# Altium schematic sheet fuentes_15V_5V_3.3V.SchDoc
size A3; PageSetup: Record=PageOptions|CenterHorizontal=True|CenterVertical=True|PrintScale=0.70|XCorrection=1.00|YCorrection=1.00|PrintKind=1|BorderSize=5000000|LeftOffset=0|BottomOffset=0|Orientation=2|PaperLength=1000|PaperWidth=1000|Scale=100|PaperSource=1|PrintQuality=300|MediaType=1|DitherType=10|PaperKind=A4|PrintScaleMode=1
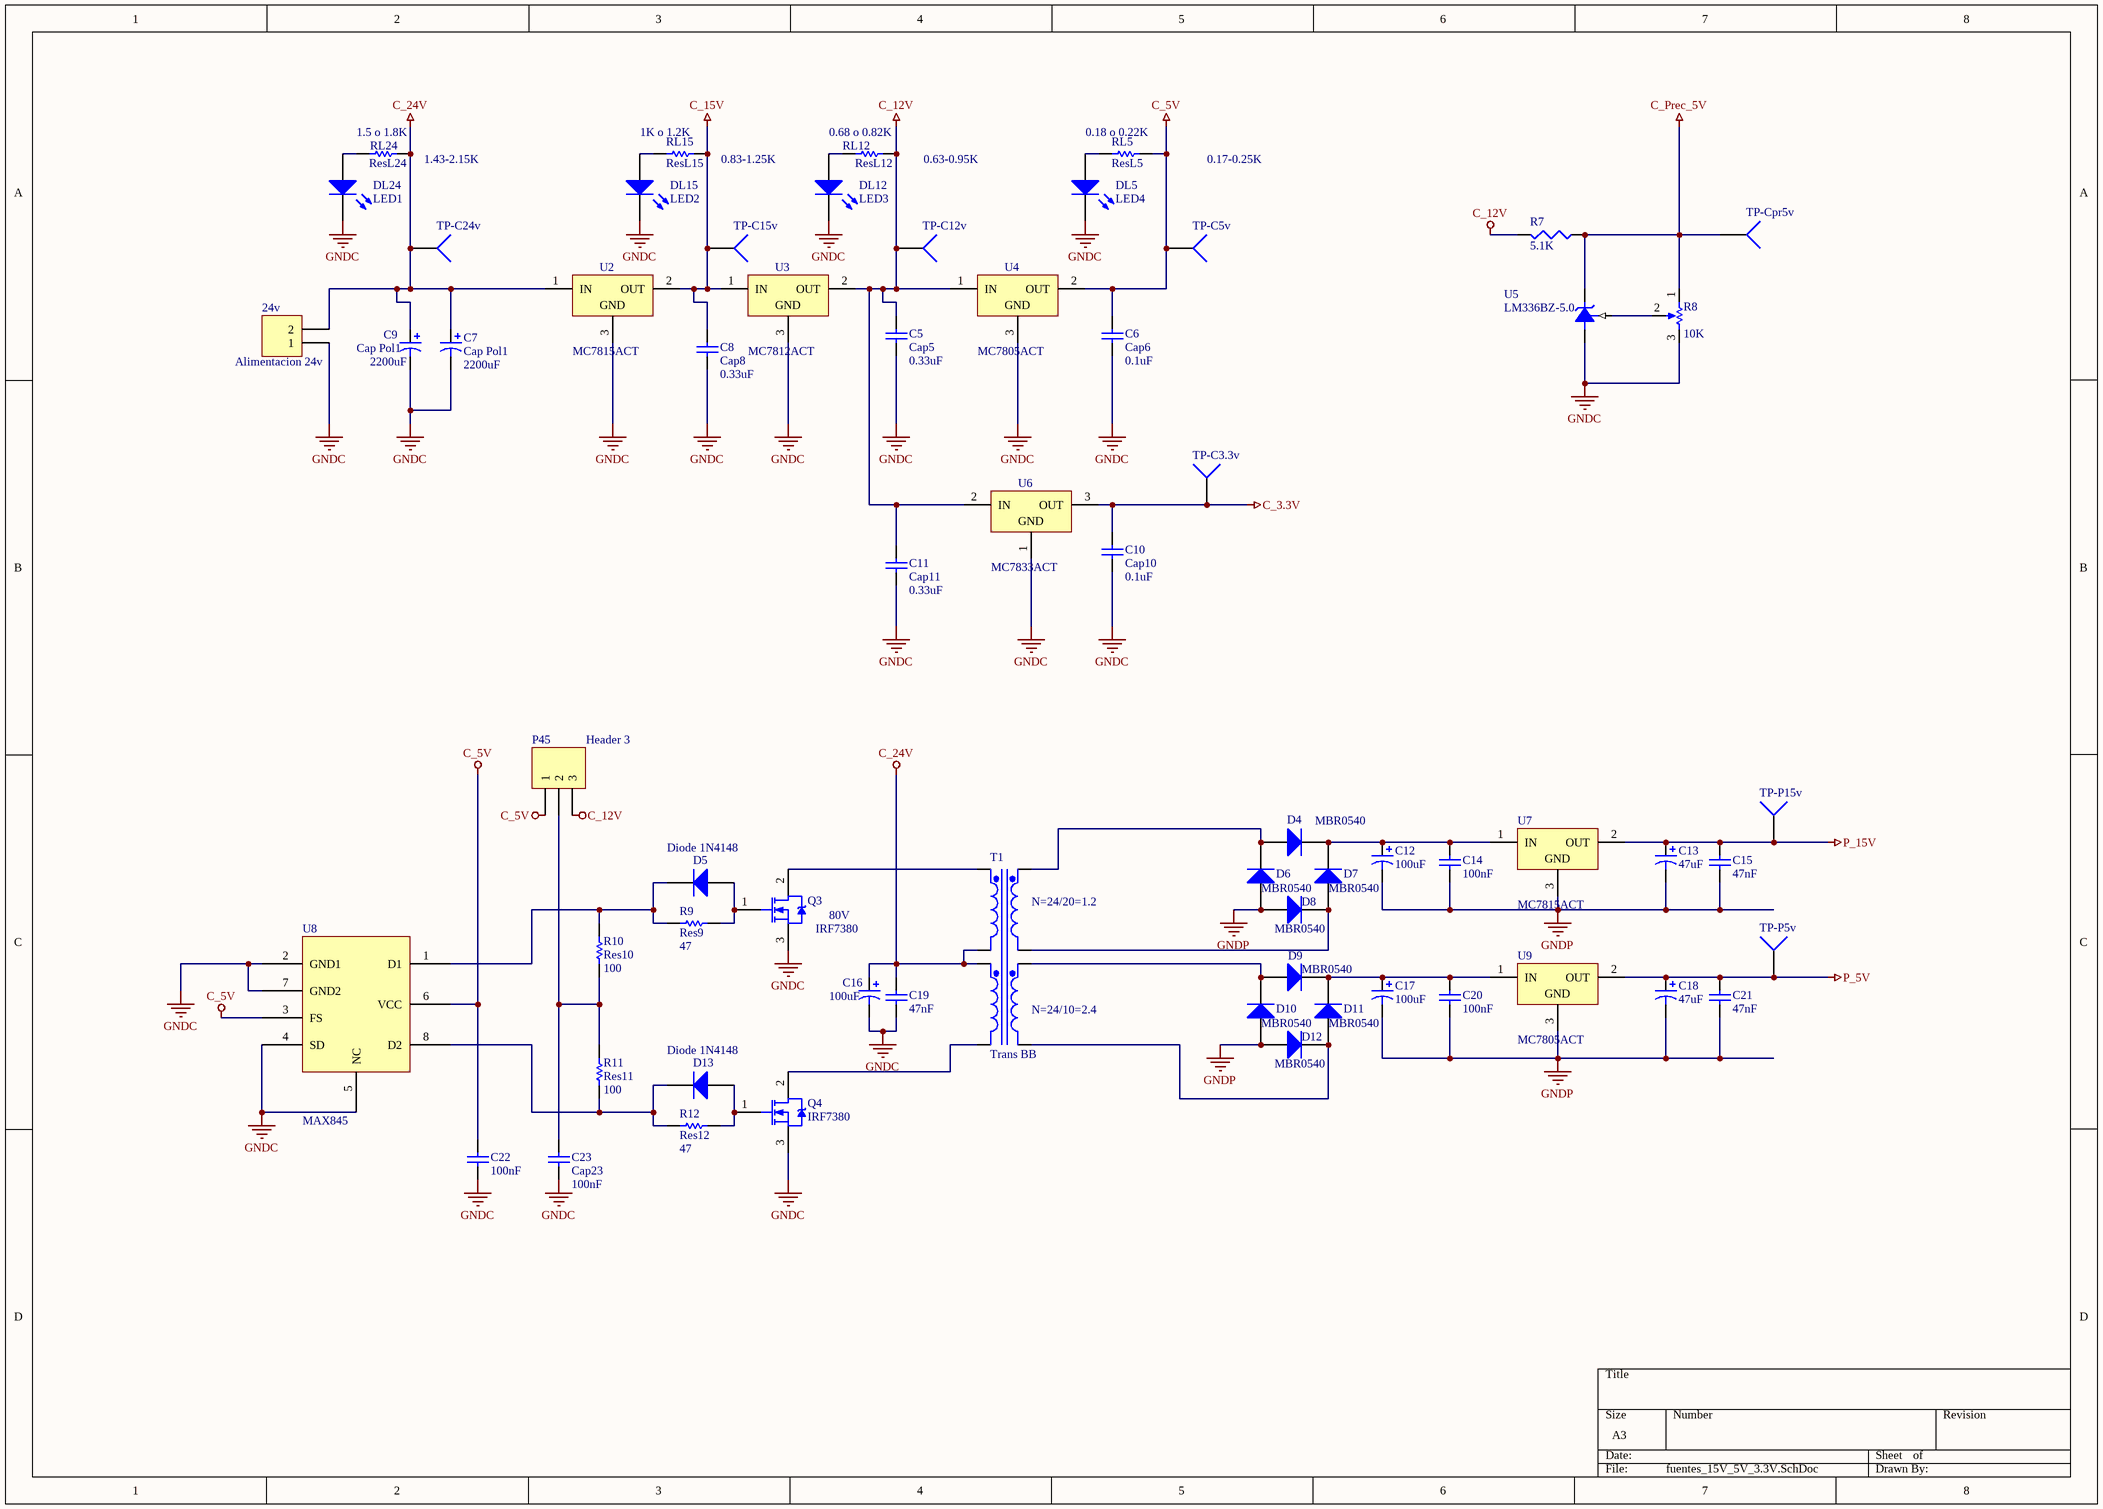
[diagram p0: fuentes_15V_5V_3.3V.SchDoc]

## Parts
24v  Alimentacion 24v  [HDR1X2-POT*]
C5  Cap5  value 0.33uF  [8-1206]
C6  Cap6  value 0.1uF  [8-1206]
C7  Cap Pol1  value 2200uF  [RB7.6-18.2*]
C8  Cap8  value 0.33uF  [8-1206]
C9  Cap Pol1  value 2200uF  [RB7.6-18.2*]
C10  Cap10  value 0.1uF  [8-1206]
C11  Cap11  value 0.33uF  [8-1206]
C12  value 100uF  [RB3.5-8*]  (hidden comment: Cap Pol1)
C13  value 47uF  [RB5.8-6.4*]  (hidden comment: Cap Pol1)
C14  value 100nF  [8-1206]  (hidden comment: Cap14)
C15  value 47nF  [8-1206]  (hidden comment: Cap15)
C16  value 100uF  [RB3.5-8*]  (hidden comment: Cap Pol1)
C17  value 100uF  [RB3.5-8*]  (hidden comment: Cap Pol1)
C18  value 47uF  [RB5.8-6.4*]  (hidden comment: Cap Pol1)
C19  value 47nF  [8-1206]  (hidden comment: Cap19)
C20  value 100nF  [8-1206]  (hidden comment: Cap20)
C21  value 47nF  [8-1206]  (hidden comment: Cap21)
C22  value 100nF  [8-1206]  (hidden comment: Cap22)
C23  Cap23  value 100nF  [8-1206]
D4  MBR0540  [CASE403A*]
D5  Diode 1N4148  [DO-35]
D6  MBR0540  [CASE403A*]
D7  MBR0540  [CASE403A*]
D8  MBR0540  [CASE403A*]
D9  MBR0540  [CASE403A*]
D10  MBR0540  [CASE403A*]
D11  MBR0540  [CASE403A*]
D12  MBR0540  [CASE403A*]
D13  Diode 1N4148  [DO-35]
DL5  LED4  [LED-1*]
DL12  LED3  [LED-1*]
DL15  LED2  [LED-1*]
DL24  LED1  [LED-1*]
P45  Header 3  [HDR1X3*]
Q3  IRF7380  [TO220-MOS]
Q4  IRF7380  [TO220-MOS]
R7  value 5.1K  [AXIAL-0.4]  (hidden comment: Res7)
R8  value 10K  [VR*]  (hidden comment: RPot)
R9  Res9  value 47  [8-1206]
R10  Res10  value 100  [8-1206]
R11  Res11  value 100  [8-1206]
R12  Res12  value 47  [8-1206]
RL5  ResL5  value 0.18 o 0.22K  [8-1206]
RL12  ResL12  value 0.68 o 0.82K  [8-1206]
RL15  ResL15  value 1K o 1.2K  [8-1206]
RL24  ResL24  value 1.5 o 1.8K  [8-1206]
T1  Trans BB  [TRAFO-2PRI-2SEC]
TP-C3.3v  (no value)  [PIN1]
TP-C5v  (no value)  [PIN1]
TP-C12v  (no value)  [PIN1]
TP-C15v  (no value)  [PIN1]
TP-C24v  (no value)  [PIN1]
TP-Cpr5v  (no value)  [PIN1]
TP-P5v  (no value)  [PIN1]
TP-P15v  (no value)  [PIN1]
U2  MC7815ACT  [TO220*]
U3  MC7812ACT  [TO220*]
U4  MC7805ACT  [TO220*]
U5  LM336BZ-5.0  [Z03A]
U6  MC7833ACT  [TO220*]
U7  MC7815ACT  [TO220*]
U8  MAX845  [SO-8]
U9  MC7805ACT  [TO220*]

## Nets
C_3.3V: C10.1 TP-C3.3v.1 U6.3(OUT)
C_5V: C6.1 C22.2 P45.1 RL5.2 TP-C5v.1 U4.2(OUT) U8.3(FS) U8.6(VCC)
C_12V: C5.1 C11.1 P45.3 R7.2 RL12.2 TP-C12v.1 U3.2(OUT) U4.1(IN) U6.2(IN)
C_15V: C8.1 RL15.2 TP-C15v.1 U2.2(OUT) U3.1(IN)
C_24V: 24v.2 C7.1 C9.1 C16.1 C19.2 RL24.2 T1.2(Pri1-) T1.3(Pri2+) TP-C24v.1 U2.1(IN)
C_Prec_5V: R7.1 R8.1(TOP) TP-Cpr5v.1 U5.2(+V)
GNDC: 24v.1 C5.2 C6.2 C7.2 C8.2 C9.2 C10.2 C11.2 C16.2 C19.1 C22.1 C23.2 DL5.2(K) DL12.2(K) DL15.2(K) DL24.2(K) Q3.3(S) Q4.3(S) R8.3(BOT) U2.3(GND) U3.3(GND) U4.3(GND) U5.1(-V) U6.1(GND) U8.2(GND1) U8.4(SD) U8.5(NC) U8.7(GND2)
GNDP: C12.2 C13.2 C14.1 C15.1 C17.2 C18.2 C20.1 C21.1 D6.1(A) D8.1(A) D10.1(A) D12.1(A) U7.3(GND) U9.3(GND)
P_5V: C18.1 C21.2 TP-P5v.1 U9.2(OUT)
P_15V: C13.1 C15.2 TP-P15v.1 U7.2(OUT)
NetC12_1: C12.1 C14.2 D4.2(K) D7.2(K) U7.1(IN)
NetC17_1: C17.1 C20.2 D9.2(K) D11.2(K) U9.1(IN)
NetC23_1: C23.1 P45.2 R10.2 R11.1
NetD4_1: D4.1(A) D6.2(K) T1.5(Sec1+)
NetD5_1: D5.1(A) Q3.1(G) R9.2
NetD5_2: D5.2(K) R9.1 R10.1 U8.1(D1)
NetD7_1: D7.1(A) D8.2(K) T1.6(Sec1-)
NetD9_1: D9.1(A) D10.2(K) T1.7(Sec2+)
NetD11_1: D11.1(A) D12.2(K) T1.8(Sec2-)
NetD13_1: D13.1(A) Q4.1(G) R12.2
NetD13_2: D13.2(K) R11.2 R12.1 U8.8(D2)
NetDL5_1: DL5.1(A) RL5.1
NetDL12_1: DL12.1(A) RL12.1
NetDL15_1: DL15.1(A) RL15.1
NetDL24_1: DL24.1(A) RL24.1
NetQ3_2: Q3.2(D) T1.1(Pri1+)
NetQ4_2: Q4.2(D) T1.4(Pri2-)
NetR8_2: R8.2(TAP) U5.3(ADJ)

## Notes on the sheet
- (near RL24) 1.43-2.15K
- (near RL15) 0.83-1.25K
- (near RL12) 0.63-0.95K
- 0.17-0.25K
- (near Q3) 80V
- (near T1) N=24/20=1.2
- (near T1) N=24/10=2.4

## Library data of the parts
24v = Header 2: Header, 2-Pin; LatestRevisionDate: 17-Jul-2002; LatestRevisionNote: Re-released for DXP Platform.; Publisher: Altium Limited
C5 C6 C8 C10 C11 C14 C15 C19-C23 = Cap: SMD MULTICAPA 50V; Published: 8-Jun-2000; LatestRevisionDate: 17-Jul-2002; LatestRevisionNote: Re-released for DXP Platform.; PackageReference: RAD-0.3; Publisher: Altium Limited
  C5 C6 C8 C10 C11 C23: PackageDescription: Radial Cap, Thru-Hole; 2 Leads; 0.3 in Pin Spacing
C7 C9 C12 C13 C16-C18 = Cap Pol1: Polarized Capacitor (Radial); Published: 8-Jun-2000; LatestRevisionDate: 17-Jul-2002; LatestRevisionNote: Re-released for DXP Platform.; PackageReference: RB7.6-15; Publisher: Altium Limited
D4 D6-D12 = Diode: SMD; Published: 8-Jun-2000; LatestRevisionDate: 17-Jul-2002; LatestRevisionNote: Re-released for DXP Platform.; PackageDocument: Sep-1996; PackageReference: SMC; Publisher: Altium Limited; Code_JEDEC: DO-214-AB
D5 D13 = Diode 1N4148: THRU; Published: 8-Jun-2000; LatestRevisionDate: 17-Jul-2002; LatestRevisionNote: Re-released for DXP Platform.; DatasheetVersion: 1997; PackageReference: DO-35; Publisher: Altium Limited; PackageDescription: Diode, Axial; Body 3.8 x 1.9 mm (LxDia. max), Lead Dia. 0.53 mm (max); Code_JEDEC: DO-204-AH; ComponentLink1Description: Manufacturer Link; ComponentLink1URL: http://www.fairchildsemi.com/; ComponentLink2Description: Datasheet; ComponentLink2URL: http://www.fairchildsemi.com/ds/1N%2F1N4148.pdf
DL5 DL12 DL15 DL24 = LED1: Typical RED GaAs LED; Published: 8-Jun-2000; LatestRevisionDate: 08-Jul-2005; LatestRevisionNote: Mech Layer 1 removed.; PackageReference: LED-1; Publisher: Altium Limited; PackageDescription: LED; 2 Leads
P45 = Header 3: Header, 3-Pin; LatestRevisionDate: 17-Jul-2002; LatestRevisionNote: Re-released for DXP Platform.; Publisher: Altium Limited
Q3 Q4 = IRFP250: HEXFET Power MOSFET; Note: Pin 2 is electrically connected to the Heatsink (4).; LatestRevisionDate: 17-Jul-2002; LatestRevisionNote: Re-released for DXP Platform.; DatasheetVersion: PD-9.443D; PackageVersion: Aug-1997; PackageReference: TO-247AC; Publisher: Altium Limited; PackageDescription: SIP with Mounting Hole; 3 Leads; Body 20 x 15.6 x 5 mm (typ); Pitch 5.45 mm; Code_JEDEC: TO-247-AC; ComponentLink1Description: Manufacturer Link; ComponentLink1URL: http://www.irf.com/; ComponentLink2Description: Datasheet; ComponentLink2URL: http://www.irf.com/product-info/datasheets/data/irfp250.pdf
  Q4: Published: 8-Jun-2000
R7 = Res3: Resistor; Published: 8-Jun-2000; LatestRevisionDate: 04-Mar-2005; LatestRevisionNote: PCB Footprint replaced.; PackageReference: J1-0603; Publisher: Altium Limited
R8 = RPot: PRESET MULTIVUELTA VERTICAL; Sim Note: Enter the Resistance value and the set point into parameter fields.; Set Position: 0.5; Published: 8-Jun-2000; LatestRevisionDate: 17-Jul-2002; LatestRevisionNote: Re-released for DXP Platform.; PackageReference: VR5; Publisher: Altium Limited
R9 R12 RL5 RL12 RL15 RL24 = Res1: SMD 1206; Published: 8-Jun-2000; LatestRevisionDate: 17-Jul-2002; LatestRevisionNote: Re-released for DXP Platform.; PackageReference: AXIAL-0.3; Publisher: Altium Limited; PackageDescription: Axial Device, Thru-Hole; 2 Leads; 0.3 in Pin Spacing
R10 R11 = Res1: Resistor; Published: 8-Jun-2000; LatestRevisionDate: 17-Jul-2002; LatestRevisionNote: Re-released for DXP Platform.; PackageReference: AXIAL-0.3; Publisher: Altium Limited; PackageDescription: Axial Device, Thru-Hole; 2 Leads; 0.3 in Pin Spacing
T1 = Trans BB: Buck-boost Transformer (Ideal); Published: 25-Jan-2001; LatestRevisionDate: 17-Jul-2002; LatestRevisionNote: Re-released for DXP Platform.; PackageReference: TRF_8; Publisher: Altium Limited; PackageDescription: Transformer; 8 Leads
TP-C3.3v TP-C5v TP-C12v TP-C15v TP-C24v TP-Cpr5v TP-P5v TP-P15v = Socket: LatestRevisionDate: 17-Jul-2002; LatestRevisionNote: Re-released for DXP Platform.; Publisher: Altium Limited
U2-U4 U6 U7 U9 = MC7805ACT: Three-Terminal Positive Voltage Regulator; Note: Heatsink surface is connected to Pin 2; Published: 15-Apr-2002; DatasheetVersion: 1997; PackageVersion: 1997; PackageReference: 221A-06; Publisher: Altium Limited; PackageDescription: TO, Thru-Hole, Vertical, Heatsink Mounted; 3 In-Line Leads; Pitch 2.54 mm; Code_JEDEC: TO-262-AA; ComponentLink1Description: Manufacturer Link; ComponentLink1URL: http://www.onsemi.com/site/products/taxonomy/0,4438,503,00.html; ComponentLink2Description: Datasheet; ComponentLink2URL: http://www.onsemi.com/pub/Collateral/MC7800-D.PDF
U5 = LM336BZ-5.0: 5.0V Reference Diode; Manufacturer: National Semiconductor; CompType: Voltage Reference IC; PackageTopMarking: NSXYTT*LM336*BZ5.0; Published: 4-Dec-2008; DatasheetVersion: Jun-2005; PackageVersion: revG, Sep-2000; PackageReference: Z03A; Publisher: Altium Limited; PackageDescription: TO-92, Molded, 3 Lead; PartNumber: LM336BZ-5.0; RoHS: O; PinCount: 3; DigiKeyPartNumber: LM336BZ-5.0-ND; Code_JEDEC: TO-226-AA; ComponentLink1Description: LM336-5.0 Datasheet; ComponentLink1URL: http://www.national.com/ds/LM/LM336-5.0.pdf; ComponentLink2Description: LM336-5.0 Web Page; ComponentLink2URL: http://www.national.com/pf/LM/LM336-5.0.html; ComponentLink3Description: Z03A Package Page; ComponentLink3URL: http://www.national.com/packaging/folders/z03a.html